# Altium schematic sheet Card Edge Connector.SchDoc: Card Edge Connector
size 292 x 193 mm; SheetNumber: 2; SheetTotal: 28
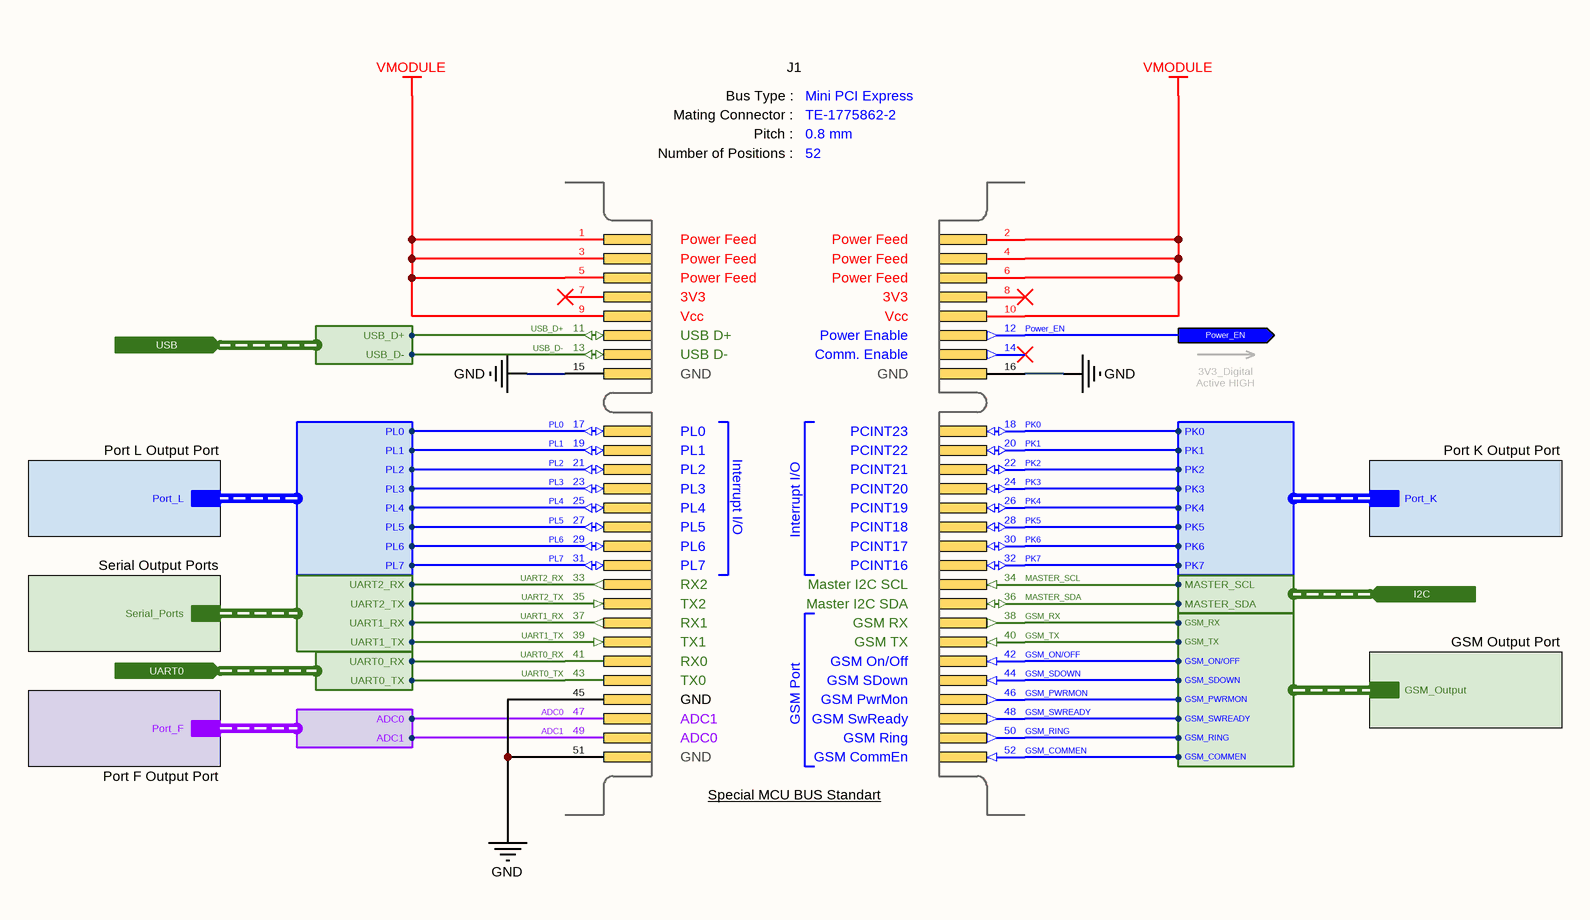
[diagram p0: Card Edge Connector.SchDoc]

## Parts
J1  BUS Type: Mini PCI Express  Mating Connector: TE-1775862-2  Pitch: 0.8 mm  Number of Positions: 52  [PCB - Mini PCI Express]  (hidden comment: PCI-E Connector)  (no BOM)

## Sub-sheets
GSM Output Port = GSM Output Port.SchDoc: GSM_Output (harness GSM_Output)
Port F Output Port = Port F Output Port.SchDoc: Port_F (harness Port_F)
Port K Output Port = Port K Output Port.SchDoc: Port_K (harness Port_K)
Port L Output Port = Port L Output Port.SchDoc: Port_L (harness Port_L)
Serial Output Ports = Serial Output Ports.SchDoc: Serial_Ports (harness Serial_Ports)

## Ports
I2C (in, harness I2C), Power_EN (out), UART0 (in, harness UART0), USB (in, harness USB)

## Harnesses
GSM_Output: GSM_SDOWN, GSM_ON/OFF, GSM_TX, GSM_RX, GSM_PWRMON, GSM_SWREADY, GSM_RING, GSM_COMMEN
Port_L: PL3, PL2, PL1, PL0, PL4, PL5, PL6, PL7
Port_K: PK3, PK2, PK1, PK0, PK4, PK5, PK6, PK7
Port_F: ADC1, ADC0
Serial_Ports: UART1_TX, UART1_RX, UART2_RX, UART2_TX
UART0: UART0_RX, UART0_TX
I2C: MASTER_SDA, MASTER_SCL
USB: USB_D+, USB_D-

## Nets
GND: J1.15(Pin-15) J1.16(Pin-16) J1.45(Pin-45) J1.51(Pin-51)
VMODULE: J1.1(Pin-1) J1.2(Pin-2) J1.3(Pin-3) J1.4(Pin-4) J1.5(Pin-5) J1.6(Pin-6) J1.9(Pin-9) J1.10(Pin-10)
ADC0: J1.47(Pin-47) ; sheet Port F Output Port/Port_F.ADC0
ADC1: J1.49(Pin-49) ; sheet Port F Output Port/Port_F.ADC1
GSM_COMMEN: J1.52(Pin-52) ; sheet GSM Output Port/GSM_Output.GSM_COMMEN
GSM_ON/OFF: J1.42(Pin-42) ; sheet GSM Output Port/GSM_Output.GSM_ON/OFF
GSM_PWRMON: J1.46(Pin-46) ; sheet GSM Output Port/GSM_Output.GSM_PWRMON
GSM_RING: J1.50(Pin-50) ; sheet GSM Output Port/GSM_Output.GSM_RING
GSM_RX: J1.38(Pin-38) ; sheet GSM Output Port/GSM_Output.GSM_RX
GSM_SDOWN: J1.44(Pin-44) ; sheet GSM Output Port/GSM_Output.GSM_SDOWN
GSM_SWREADY: J1.48(Pin-48) ; sheet GSM Output Port/GSM_Output.GSM_SWREADY
GSM_TX: J1.40(Pin-40) ; sheet GSM Output Port/GSM_Output.GSM_TX
MASTER_SCL: J1.34(Pin-34) ; port I2C.MASTER_SCL
MASTER_SDA: J1.36(Pin-36) ; port I2C.MASTER_SDA
PK0: J1.18(Pin-18) ; sheet Port K Output Port/Port_K.PK0
PK1: J1.20(Pin-20) ; sheet Port K Output Port/Port_K.PK1
PK2: J1.22(Pin-22) ; sheet Port K Output Port/Port_K.PK2
PK3: J1.24(Pin-24) ; sheet Port K Output Port/Port_K.PK3
PK4: J1.26(Pin-26) ; sheet Port K Output Port/Port_K.PK4
PK5: J1.28(Pin-28) ; sheet Port K Output Port/Port_K.PK5
PK6: J1.30(Pin-30) ; sheet Port K Output Port/Port_K.PK6
PK7: J1.32(Pin-32) ; sheet Port K Output Port/Port_K.PK7
PL0: J1.17(Pin-17) ; sheet Port L Output Port/Port_L.PL0
PL1: J1.19(Pin-19) ; sheet Port L Output Port/Port_L.PL1
PL2: J1.21(Pin-21) ; sheet Port L Output Port/Port_L.PL2
PL3: J1.23(Pin-23) ; sheet Port L Output Port/Port_L.PL3
PL4: J1.25(Pin-25) ; sheet Port L Output Port/Port_L.PL4
PL5: J1.27(Pin-27) ; sheet Port L Output Port/Port_L.PL5
PL6: J1.29(Pin-29) ; sheet Port L Output Port/Port_L.PL6
PL7: J1.31(Pin-31) ; sheet Port L Output Port/Port_L.PL7
Power_EN: J1.12(Pin-12) ; port Power_EN
UART0_RX: J1.41(Pin-41) ; port UART0.UART0_RX
UART0_TX: J1.43(Pin-43) ; port UART0.UART0_TX
UART1_RX: J1.37(Pin-37) ; sheet Serial Output Ports/Serial_Ports.UART1_RX
UART1_TX: J1.39(Pin-39) ; sheet Serial Output Ports/Serial_Ports.UART1_TX
UART2_RX: J1.33(Pin-33) ; sheet Serial Output Ports/Serial_Ports.UART2_RX
UART2_TX: J1.35(Pin-35) ; sheet Serial Output Ports/Serial_Ports.UART2_TX
USB_D+: J1.11(Pin-11) ; port USB.USB_D+
USB_D-: J1.13(Pin-13) ; port USB.USB_D-

Not connected (* = marked no-connect by the designer): J1 7(Pin-7)* 8(Pin-8)* 14(Pin-14)*

## Notes on the sheet
- 3V3_Digital
  Active HIGH
- © 2021 All rights reserved.
  This document may not, in whole or in part, be copied, photocopied, reproduced, translated or converted to any electronic or machine readable from without prior written permission of Mehmet Günce Akkoyun.
  Engineer contact : akkoyun@me.com
- Property of
- Engineer :
- Date :
- Size :
- A4
- Time :
- Project :
- Page :
- /
- Customer :
- Product ID :
- Module ID :
- Version :
- File :
- Revision :
- (in symbol Connector - Mini PCI-E [MCU]) Bus Type :; Mating Connector :; Pitch :; Number of Positions :; Power Feed; 3V3; Vcc; USB D+; Power Enable; USB D-; Comm. Enable; GND; PL0; PCINT23; PL1; PCINT22; Interrupt I/O; PL2; PCINT21; PL3; PCINT20; PL4; PCINT19; PL5; PCINT18; PL6; PCINT17; PL7; PCINT16; RX2; Master I2C SCL; TX2; Master I2C SDA; RX1; GSM RX; TX1; GSM TX; RX0; GSM Port; GSM On/Off; TX0; GSM SDown; GSM PwrMon; ADC1; GSM SwReady; ADC0; GSM Ring; GSM CommEn; Special MCU BUS Standart

## Library data of the parts
J1 = Connector - Mini PCI-E [MCU]: Mini PCI-Express gold finger connector.; System: Connector